# Altium project AMS_Slave.PrjPCB
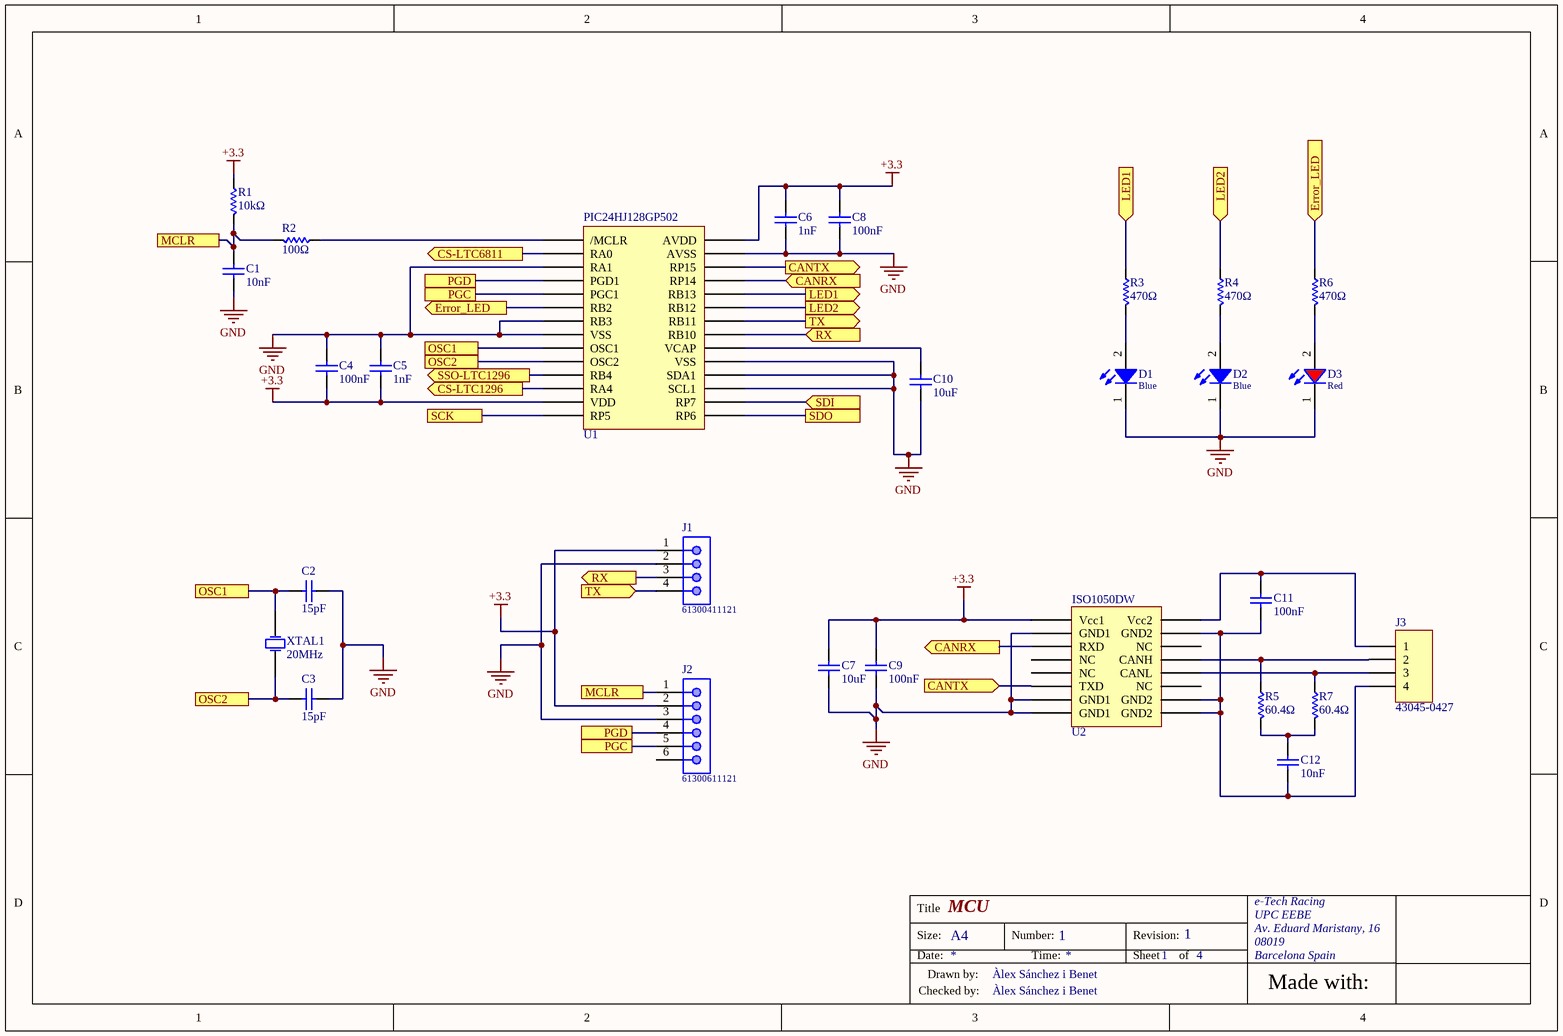
[diagram p0: AMS_MCU.SchDoc]
4 sheets, 190 parts. Net scope: flat (ports and power ports of the same name join across sheets).
Board file: AMS_Slave.PcbDoc
Sheets:
  AMS_MCU.SchDoc
  AMS_balancing.SchDoc
  AMS_supply.SchDoc
  AMS_temperature.SchDoc

## Sheet AMS_MCU.SchDoc: MCU
size A4; CheckedBy: Àlex Sánchez i Benet; DrawnBy: Àlex Sánchez i Benet; DocumentNumber: 1; Revision: 1; SheetNumber: 1; SheetTotal: 4; University: UPC EEBE; City: Barcelona; Country: Spain; CP: 08019; Address: Av. Eduard Maristany, 16

### Parts
C1  10nF  [0805_2x1.25x0.8mm_Reflow Soldering]
C2  15pF  [0805_2x1.25x0.6mm_Reflow Soldering]
C3  15pF  [0805_2x1.25x0.6mm_Reflow Soldering]
C4  100nF  [0805_2x1.25x0.8mm_Reflow Soldering]
C5  1nF  [0805_2x1.25x0.8mm_Reflow Soldering]
C6  1nF  [0805_2x1.25x0.8mm_Reflow Soldering]
C7  10uF  [0805_2x1.25x1.25mm_Reflow Soldering]
C8  100nF  [0805_2x1.25x0.8mm_Reflow Soldering]
C9  100nF  [0805_2x1.25x0.8mm_Reflow Soldering]
C10  10uF  [0805_2x1.25x1.25mm_Reflow Soldering]
C11  100nF  [0805_2x1.25x0.8mm_Reflow Soldering]
C12  10nF  [0805_2x1.25x0.8mm_Reflow Soldering]
D1  Blue  [WL-SMCW_0805]
D2  Blue  [WL-SMCW_0805]
D3  Red  [WL-SMCW_0805]
J1  61300411121  [61300411121]
J2  61300611121  [61300611121]
J3  43045-0427  [43045-0427]
R1  10kΩ  [CR0805]
R2  100Ω  [CR0805]
R3  470Ω  [CR0805]
R4  470Ω  [CR0805]
R5  60.4Ω  [CR0805]
R6  470Ω  [CR0805]
R7  60.4Ω  [CR0805]
U1  PIC24HJ128GP502  [PIC24HJ128GP502]
U2  ISO1050DW  [ISO1050DW]
XTAL1  20MHz  [830028710]

### Ports
CANRX (in), CANRX (out), CANTX (in), CANTX (out), CS-LTC1296 (out), CS-LTC6811 (out), Error_LED (in), Error_LED (out), LED1 (in), LED1 (out), LED2 (in), LED2 (out), MCLR, OSC1, OSC2, PGC, PGD, RX (in), RX (out), SCK, SDI (in), SDO, SSO-LTC1296 (out), TX (in), TX (out)

### Nets
+3.3: C4.1 C5.1 C6.2 C7.2 C8.2 C9.2 J1.1 J2.2 R1.2 U1.13(VDD) U1.28(AVDD) U2.1(Vcc1)
GND: C1.1 C2.2 C3.2 C4.2 C5.2 C6.1 C7.1 C8.1 C9.1 C10.1 D1.1(K) D2.1(K) D3.1(K) J1.2 J2.3 U1.3(RA1) U1.7(RB3) U1.8(VSS) U1.17(SCL1) U1.18(SDA1) U1.19(VSS) U1.27(AVSS) U2.2(GND1) U2.7(GND1) U2.8(GND1)
NetC1_2: C1.2 J2.1 R1.1 R2.1 ; port MCLR
NetC2_1: C2.1 U1.9(OSC1) XTAL1.2(OSC2) ; port OSC1
NetC3_1: C3.1 U1.10(OSC2) XTAL1.1(OSC1) ; port OSC2
NetC10_2: C10.2 U1.20(VCAP)
NetC11_1: C11.1 C12.1 J3.4 U2.9(GND2) U2.10(GND2) U2.15(GND2)
NetC11_2: C11.2 J3.1 U2.16(Vcc2)
NetC12_2: C12.2 R5.1 R7.1
NetD1_2: D1.2(A) R3.1
NetD2_2: D2.2(A) R4.1
NetD3_2: D3.2(A) R6.1
NetJ1_3: J1.3 U1.21(RB10) ; port RX
NetJ1_4: J1.4 U1.22(RB11) ; port TX
NetJ2_4: J2.4 U1.4(PGD1) ; port PGD
NetJ2_5: J2.5 U1.5(PGC1) ; port PGC
NetJ3_2: J3.2 R5.2 U2.13(CANH)
NetJ3_3: J3.3 R7.2 U2.12(CANL)
NetR2_2: R2.2 U1.1(/MCLR)
NetR3_2: R3.2 U1.24(RB13) ; port LED1
NetR4_2: R4.2 U1.23(RB12) ; port LED2
NetR6_2: R6.2 U1.6(RB2) ; port Error_LED
NetR57_1: U1.2(RA0) ; port CS-LTC6811
NetR58_1: U1.14(RP5) ; port SCK
NetR59_1: U1.15(RP6) ; port SDO
NetR60_1: U1.16(RP7) ; port SDI
NetR71_1: U1.11(RB4) ; port SSO-LTC1296
NetR72_1: U1.12(RA4) ; port CS-LTC1296
NetU1_25: U1.25(RP14) U2.3(RXD) ; port CANRX
NetU1_26: U1.26(RP15) U2.6(TXD) ; port CANTX

Not connected (* = marked no-connect by the designer): J2 6; U2 4(NC) 5(NC) 11(NC) 14(NC)

### Notes on the sheet
- Title
- e-Tech Racing
- UPC EEBE
- Size:
- Date:
- Drawn by:
- A4
- Number:
- Time:
- Revision:
- Sheet
- of
- Av. Eduard Maristany, 16
- 08019
- Barcelona Spain
- Made with:
- Checked by:

### Library data of the parts
C1 C12 = 885012207092: WCAP-CSGP Ceramic Capacitors, 0805, X7R, 50V, 10nF; Rated Voltage: 50V DC; ComponentLink1Description: Manufacturer; ComponentLink1URL: http://www.we-online.de; ComponentLink2Description: Datasheet; ComponentLink2URL: http://katalog.we-online.de/pbs/datasheet/885012207092.pdf; Part Number: 885012207092; Publisher: Wurth Elektronik; Size: 0805; Operating Temperature: -55 °C to +125 °C; Value: 10nF; Ceramic Type: X7R
C2 C3 = 885012007052: WCAP-CSGP Ceramic Capacitors, 0805, NP0, 50V, 15pF; Rated Voltage: 50V DC; ComponentLink1Description: Manufacturer; ComponentLink1URL: http://www.we-online.de; ComponentLink2Description: Datasheet; ComponentLink2URL: http://katalog.we-online.de/pbs/datasheet/885012007052.pdf; Part Number: 885012007052; Published Date: Oct. 2017; Publisher: Wurth Elektronik; Size: 0805; Operating Temperature: -55 °C to +125 °C; Value: 15pF; Ceramic Type: NP0
C4 C8 C9 C11 = 885012207098: WCAP-CSGP Ceramic Capacitors, 0805, X7R, 50V, 100nF; Rated Voltage: 50V DC; ComponentLink1Description: Manufacturer; ComponentLink1URL: http://www.we-online.de; ComponentLink2Description: Datasheet; ComponentLink2URL: http://katalog.we-online.de/pbs/datasheet/885012207098.pdf; Part Number: 885012207098; Publisher: Wurth Elektronik; Size: 0805; Operating Temperature: -55 °C to +125 °C; Value: 100nF; Ceramic Type: X7R
C5 C6 = 885012007063: WCAP-CSGP Ceramic Capacitors, 0805, NP0, 50V, 1nF; Rated Voltage: 50V DC; ComponentLink1Description: Manufacturer; ComponentLink1URL: http://www.we-online.de; ComponentLink2Description: Datasheet; ComponentLink2URL: http://katalog.we-online.de/pbs/datasheet/885012007063.pdf; Part Number: 885012007063; Published Date: Oct. 2017; Publisher: Wurth Elektronik; Size: 0805; Operating Temperature: -55 °C to +125 °C; Value: 1nF; Ceramic Type: NP0
C7 C10 = 885012107014: WCAP-CSGP Ceramic Capacitors, 0805, X5R, 16V, 10uF; Rated Voltage: 16V DC; ComponentLink1Description: Manufacturer; ComponentLink1URL: http://www.we-online.de; ComponentLink2Description: Datasheet; ComponentLink2URL: http://katalog.we-online.de/pbs/datasheet/885012107014.pdf; Part Number: 885012107014; Published Date: Oct. 2017; Publisher: Wurth Elektronik; Size: 0805; Operating Temperature: -55 °C to +125 °C; Value: 10uF; Ceramic Type: X5R
D1 D2 = 150080BS75000: SMT Mono-color Chip LED Waterclear WL-SMCW, size 0805, Blue, 3.2 V, 140 deg, 145 mcd; Forward Voltage: 3.2 V; Viewing Angle: 140 deg; Peak Wavelength: 465 nm; Dominant Wavelength: 470 nm; Luminous Intensity: 145 mcd; Chip Technology: InGaN; ComponentLink1Description: Manufacturer; ComponentLink1URL: http://www.we-online.de; ComponentLink2Description: Datasheet; ComponentLink2URL: https://katalog.we-online.de/led/datasheet/150080BS75000.pdf; Part Number: 150080BS75000; Published Date: November 2018; Publisher: Wurth Elektronik; Size: 0805; Operating Temperature: -40 to 85 degC; Emitting Color: Blue; Mounting Technology: SMT; Packaging: Tape and Reel
D3 = 150080RS75000: SMT Mono-color Chip LED Waterclear WL-SMCW, size 0805, Red, 2 V, 140 deg, 150 mcd; Forward Voltage: 2 V; Viewing Angle: 140 deg; Peak Wavelength: 630 nm; Dominant Wavelength: 625 nm; Luminous Intensity: 150 mcd; Chip Technology: AlInGaP; ComponentLink1Description: Manufacturer; ComponentLink1URL: http://www.we-online.de; ComponentLink2Description: Datasheet; ComponentLink2URL: https://katalog.we-online.de/led/datasheet/150080RS75000.pdf; Part Number: 150080RS75000; Published Date: November 2018; Publisher: Wurth Elektronik; Size: 0805; Operating Temperature: -40 to 85 degC; Emitting Color: Red; Mounting Technology: SMT; Packaging: Tape and Reel
J1 = 61300411121: THT Vertical Pin Header WR-PHD, Pitch 2.54 mm, Single Row, 4 pins; Pin Number: 4; Pitch: 2.54 mm; Gender: Male; Rated Current: 3 A; Working Voltage: 250 VAC; Withstanding Voltage: 500 VAC; Contact Resistance: 20 mOhm; ComponentLink1Description: Manufacturer; ComponentLink1URL: http://www.we-online.de; ComponentLink2Description: Datasheet; ComponentLink2URL: https://katalog.we-online.de/em/datasheet/6130xx11121.pdf; Part Number: 61300411121; Published Date: August 2018; Publisher: Wurth Elektronik; Operating Temperature: -40 to 105 degC; Mounting Technology: THT; Packaging: Bag; Row Number: Single; Orientation: Vertical
J2 = 61300611121: THT Vertical Pin Header WR-PHD, Pitch 2.54 mm, Single Row, 6 pins; Pin Number: 6; Pitch: 2.54 mm; Gender: Male; Rated Current: 3 A; Working Voltage: 250 VAC; Withstanding Voltage: 500 VAC; Contact Resistance: 20 mOhm; ComponentLink1Description: Manufacturer; ComponentLink1URL: http://www.we-online.de; ComponentLink2Description: Datasheet; ComponentLink2URL: https://katalog.we-online.de/em/datasheet/6130xx11121.pdf; Part Number: 61300611121; Published Date: August 2018; Publisher: Wurth Elektronik; Operating Temperature: -40 to 105 degC; Mounting Technology: THT; Packaging: Bag; Row Number: Single; Orientation: Vertical
J3 = 43045-0427: Micro-Fit 3.0 Vertical Header, 3.00mm Pitch, Dual Row, 4 Circuits, Black; Manufacturer: Molex; Rated Voltage: 600V DC; Rated Current: 8.5A; Circuits: 4; Operating Temperature: -40° to +105°C; Number of Rows: 2; ComponentLink1Description: Datasheet; ComponentLink1URL: https://www.molex.com/webdocs/datasheets/pdf/en-us/0430450427_PCB_HEADERS.pdf
R1 = CR0805-JW-103ELF: Chip Resistor 0805; Manufacturer: Bourns; ComponentLink1Description: Datasheet; ComponentLink1URL: https://www.bourns.com/docs/product-datasheets/chpreztr.pdf?sfvrsn=566c91f1_11
R2 = CR0805-FX-1000ELF: Chip Resistor 0805; Manufacturer: Bourns; ComponentLink1Description: Datasheet; ComponentLink1URL: https://www.bourns.com/docs/product-datasheets/chpreztr.pdf?sfvrsn=566c91f1_11
R3 R4 R6 = CR0805-FX-4700GLF: Chip Resistor 0805; Manufacturer: Bourns; ComponentLink1Description: Datasheet; ComponentLink1URL: https://www.bourns.com/docs/product-datasheets/chpreztr.pdf?sfvrsn=566c91f1_11
R5 R7 = ERA6AEB60R4V: Chip Resistor 0805; Manufacturer: Panasonic; ComponentLink1Description: Datasheet; ComponentLink1URL: https://www.bourns.com/docs/product-datasheets/chpreztr.pdf?sfvrsn=566c91f1_11
U1 = PIC24HJ128GP502: 16-bit Microcontroller / (up to 128 KB Flash and 8K SRAM) with Advanced Analog; Manufacturer: Microchip; Pins: 28; ComponentLink1Description: Datasheet; ComponentLink1URL: http://ww1.microchip.com/downloads/en/devicedoc/70293g.pdf
U2 = ISO1050DW: Galvanically isolated CAN / transceiver; Manufacturer: Texas Instruments; Pins: 16; ComponentLink1Description: Datasheet; ComponentLink1URL: http://www.ti.com/lit/ds/symlink/iso1050.pdf
XTAL1 = 830028710: Industry standard SMD crystal WE-XTAL Quartz Crystal; Manufacturer: Wurth Elektronik; Model: HC49/4HSMX; ComponentLink1Description: Datasheet; ComponentLink1URL: https://katalog.we-online.com/pbs/datasheet/830028710.pdf; Mounting Technology: SMT; Frequency: 20MHz

## Sheet AMS_balancing.SchDoc: Balancing Stage
size A3 portrait; CheckedBy: Àlex Sánchez i Benet; DrawnBy: Àlex Sánchez i Benet; DocumentNumber: 1; Revision: 1; SheetNumber: 2; SheetTotal: 4
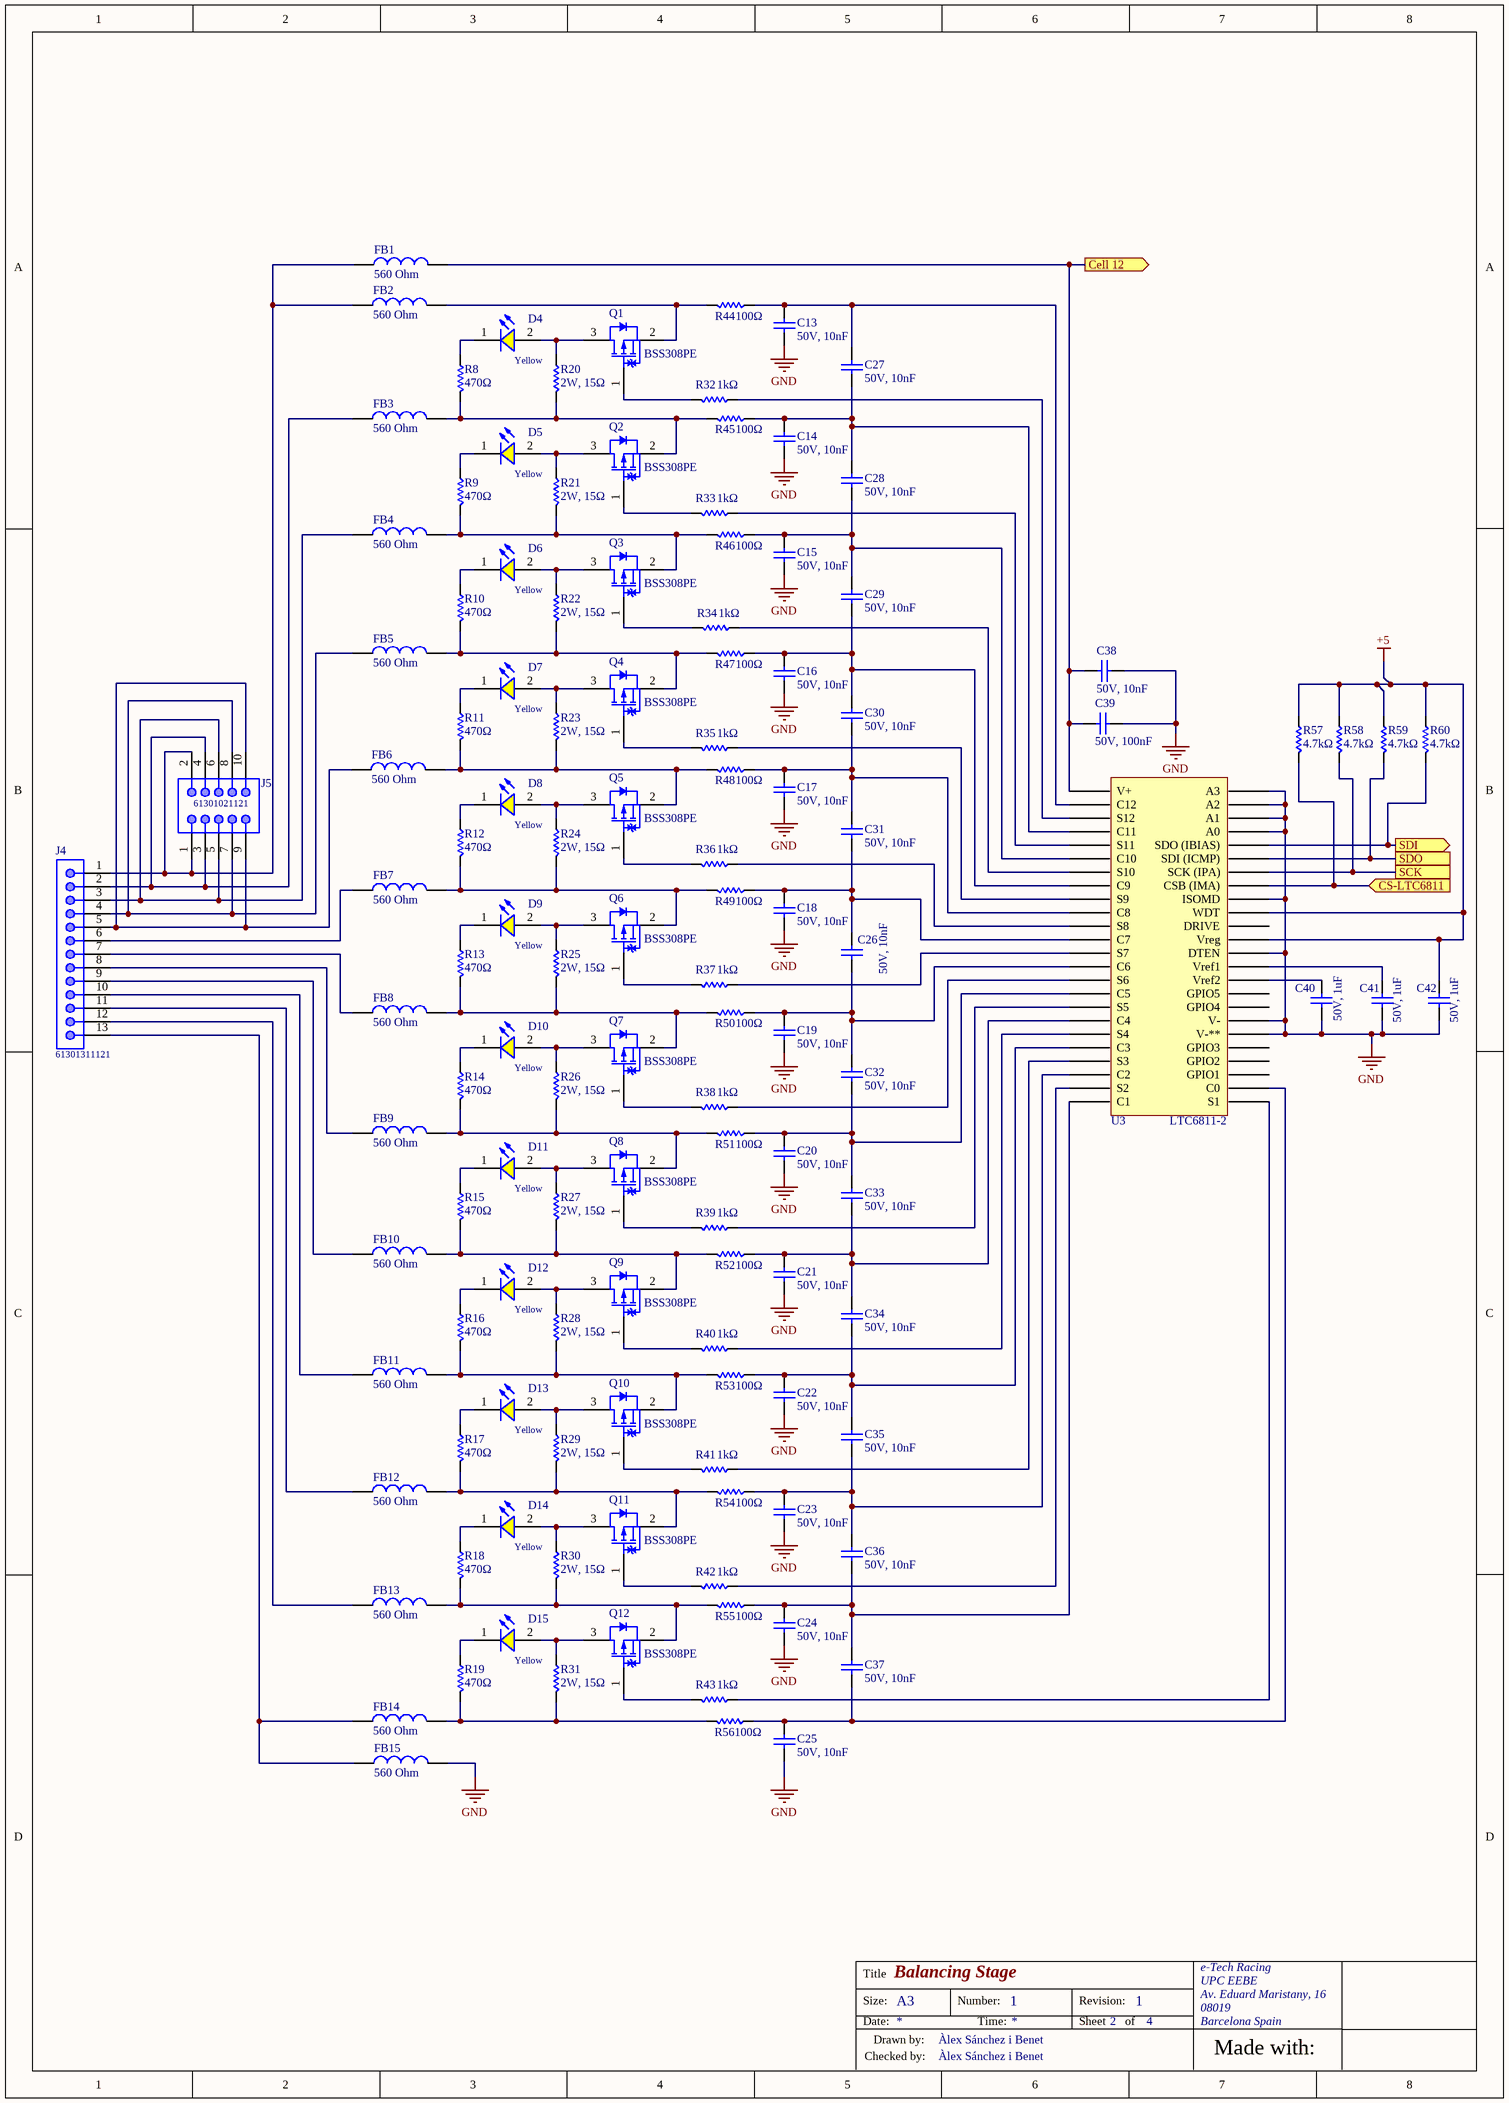
[diagram p1: AMS_balancing.SchDoc]

### Parts
C13  50V, 10nF  [0805_2x1.25x0.8mm_Reflow Soldering]
C14  50V, 10nF  [0805_2x1.25x0.8mm_Reflow Soldering]
C15  50V, 10nF  [0805_2x1.25x0.8mm_Reflow Soldering]
C16  50V, 10nF  [0805_2x1.25x0.8mm_Reflow Soldering]
C17  50V, 10nF  [0805_2x1.25x0.8mm_Reflow Soldering]
C18  50V, 10nF  [0805_2x1.25x0.8mm_Reflow Soldering]
C19  50V, 10nF  [0805_2x1.25x0.8mm_Reflow Soldering]
C20  50V, 10nF  [0805_2x1.25x0.8mm_Reflow Soldering]
C21  50V, 10nF  [0805_2x1.25x0.8mm_Reflow Soldering]
C22  50V, 10nF  [0805_2x1.25x0.8mm_Reflow Soldering]
C23  50V, 10nF  [0805_2x1.25x0.8mm_Reflow Soldering]
C24  50V, 10nF  [0805_2x1.25x0.8mm_Reflow Soldering]
C25  50V, 10nF  [0805_2x1.25x0.8mm_Reflow Soldering]
C26  50V, 10nF  [0805_2x1.25x0.8mm_Reflow Soldering]
C27  50V, 10nF  [0805_2x1.25x0.8mm_Reflow Soldering]
C28  50V, 10nF  [0805_2x1.25x0.8mm_Reflow Soldering]
C29  50V, 10nF  [0805_2x1.25x0.8mm_Reflow Soldering]
C30  50V, 10nF  [0805_2x1.25x0.8mm_Reflow Soldering]
C31  50V, 10nF  [0805_2x1.25x0.8mm_Reflow Soldering]
C32  50V, 10nF  [0805_2x1.25x0.8mm_Reflow Soldering]
C33  50V, 10nF  [0805_2x1.25x0.8mm_Reflow Soldering]
C34  50V, 10nF  [0805_2x1.25x0.8mm_Reflow Soldering]
C35  50V, 10nF  [0805_2x1.25x0.8mm_Reflow Soldering]
C36  50V, 10nF  [0805_2x1.25x0.8mm_Reflow Soldering]
C37  50V, 10nF  [0805_2x1.25x0.8mm_Reflow Soldering]
C38  50V, 10nF  [0805_2x1.25x0.8mm_Reflow Soldering]
C39  50V, 100nF  [0805_2x1.25x0.8mm_Reflow Soldering]
C40  50V, 1uF  [0805_2x1.25x1.25mm_Reflow Soldering]
C41  50V, 1uF  [0805_2x1.25x1.25mm_Reflow Soldering]
C42  50V, 1uF  [0805_2x1.25x1.25mm_Reflow Soldering]
D4  Yellow  [WL-SMCW_0805]
D5  Yellow  [WL-SMCW_0805]
D6  Yellow  [WL-SMCW_0805]
D7  Yellow  [WL-SMCW_0805]
D8  Yellow  [WL-SMCW_0805]
D9  Yellow  [WL-SMCW_0805]
D10  Yellow  [WL-SMCW_0805]
D11  Yellow  [WL-SMCW_0805]
D12  Yellow  [WL-SMCW_0805]
D13  Yellow  [WL-SMCW_0805]
D14  Yellow  [WL-SMCW_0805]
D15  Yellow  [WL-SMCW_0805]
FB1  560 Ohm  [0805_High Current]
FB2  560 Ohm  [0805_High Current]
FB3  560 Ohm  [0805_High Current]
FB4  560 Ohm  [0805_High Current]
FB5  560 Ohm  [0805_High Current]
FB6  560 Ohm  [0805_High Current]
FB7  560 Ohm  [0805_High Current]
FB8  560 Ohm  [0805_High Current]
FB9  560 Ohm  [0805_High Current]
FB10  560 Ohm  [0805_High Current]
FB11  560 Ohm  [0805_High Current]
FB12  560 Ohm  [0805_High Current]
FB13  560 Ohm  [0805_High Current]
FB14  560 Ohm  [0805_High Current]
FB15  560 Ohm  [0805_High Current]
J4  61301311121  [61301311121-bottom]
J5  61301021121  [61301021121]
Q1  BSS308PE  [INF-PG-SOT23_N]
Q2  BSS308PE  [INF-PG-SOT23_N]
Q3  BSS308PE  [INF-PG-SOT23_N]
Q4  BSS308PE  [INF-PG-SOT23_N]
Q5  BSS308PE  [INF-PG-SOT23_N]
Q6  BSS308PE  [INF-PG-SOT23_N]
Q7  BSS308PE  [INF-PG-SOT23_N]
Q8  BSS308PE  [INF-PG-SOT23_N]
Q9  BSS308PE  [INF-PG-SOT23_N]
Q10  BSS308PE  [INF-PG-SOT23_N]
Q11  BSS308PE  [INF-PG-SOT23_N]
Q12  BSS308PE  [INF-PG-SOT23_N]
R8  470Ω  [CR0805]
R9  470Ω  [CR0805]
R10  470Ω  [CR0805]
R11  470Ω  [CR0805]
R12  470Ω  [CR0805]
R13  470Ω  [CR0805]
R14  470Ω  [CR0805]
R15  470Ω  [CR0805]
R16  470Ω  [CR0805]
R17  470Ω  [CR0805]
R18  470Ω  [CR0805]
R19  470Ω  [CR0805]
R20  2W, 15Ω  [352115RFT]
R21  2W, 15Ω  [352115RFT]
R22  2W, 15Ω  [352115RFT]
R23  2W, 15Ω  [352115RFT]
R24  2W, 15Ω  [352115RFT]
R25  2W, 15Ω  [352115RFT]
R26  2W, 15Ω  [352115RFT]
R27  2W, 15Ω  [352115RFT]
R28  2W, 15Ω  [352115RFT]
R29  2W, 15Ω  [352115RFT]
R30  2W, 15Ω  [352115RFT]
R31  2W, 15Ω  [352115RFT]
R32  1kΩ  [CR0805]
R33  1kΩ  [CR0805]
R34  1kΩ  [CR0805]
R35  1kΩ  [CR0805]
R36  1kΩ  [CR0805]
R37  1kΩ  [CR0805]
R38  1kΩ  [CR0805]
R39  1kΩ  [CR0805]
R40  1kΩ  [CR0805]
R41  1kΩ  [CR0805]
R42  1kΩ  [CR0805]
R43  1kΩ  [CR0805]
R44  100Ω  [CR0805]
R45  100Ω  [CR0805]
R46  100Ω  [CR0805]
R47  100Ω  [CR0805]
R48  100Ω  [CR0805]
R49  100Ω  [CR0805]
R50  100Ω  [CR0805]
R51  100Ω  [CR0805]
R52  100Ω  [CR0805]
R53  100Ω  [CR0805]
R54  100Ω  [CR0805]
R55  100Ω  [CR0805]
R56  100Ω  [CR0805]
R57  4.7kΩ  [CR0805]
R58  4.7kΩ  [CR0805]
R59  4.7kΩ  [CR0805]
R60  4.7kΩ  [CR0805]
U3  LTC6811-2  [LTC6811-2]

### Ports
Cell 12 (out), CS-LTC6811 (in), SCK, SDI (out), SDO

### Nets
+5: C42.2 R57.2 R58.2 R59.2 R60.2 U3.37(Vreg) U3.39(WDT)
GND: C13.1 C14.1 C15.1 C16.1 C17.1 C18.1 C19.1 C20.1 C21.1 C22.1 C23.1 C24.1 C25.1 C38.2 C39.2 C40.1 C41.1 C42.1 FB15.2 U3.30(V-**) U3.31(V-) U3.36(DTEN) U3.40(ISOMD) U3.45(A0) U3.46(A1) U3.47(A2) U3.48(A3)
NetC13_2: C13.2 C27.2 R44.2 U3.2(C12)
NetC14_2: C14.2 C27.1 C28.2 R45.2 U3.4(C11)
NetC15_2: C15.2 C28.1 C29.2 R46.2 U3.6(C10)
NetC16_2: C16.2 C29.1 C30.2 R47.2 U3.8(C9)
NetC17_2: C17.2 C30.1 C31.2 R48.2 U3.10(C8)
NetC18_2: C18.2 C26.2 C31.1 R49.2 U3.12(C7)
NetC19_2: C19.2 C26.1 C32.2 R50.2 U3.14(C6)
NetC20_2: C20.2 C32.1 C33.2 R51.2 U3.16(C5)
NetC21_2: C21.2 C33.1 C34.2 R52.2 U3.18(C4)
NetC22_2: C22.2 C34.1 C35.2 R53.2 U3.20(C3)
NetC23_2: C23.2 C35.1 C36.2 R54.2 U3.22(C2)
NetC24_2: C24.2 C36.1 C37.2 R55.2 U3.24(C1)
NetC25_2: C25.2 C37.1 R56.2 U3.26(C0)
NetC38_1: C38.1 C39.1 FB1.2 U3.1(V+) ; port Cell 12
NetC40_2: C40.2 U3.34(Vref2)
NetC41_2: C41.2 U3.35(Vref1)
NetD4_1: D4.1(K) R8.2
NetD4_2: D4.2(A) Q1.3(DRAIN) R20.2
NetD5_1: D5.1(K) R9.2
NetD5_2: D5.2(A) Q2.3(DRAIN) R21.2
NetD6_1: D6.1(K) R10.2
NetD6_2: D6.2(A) Q3.3(DRAIN) R22.2
NetD7_1: D7.1(K) R11.2
NetD7_2: D7.2(A) Q4.3(DRAIN) R23.2
NetD8_1: D8.1(K) R12.2
NetD8_2: D8.2(A) Q5.3(DRAIN) R24.2
NetD9_1: D9.1(K) R13.2
NetD9_2: D9.2(A) Q6.3(DRAIN) R25.2
NetD10_1: D10.1(K) R14.2
NetD10_2: D10.2(A) Q7.3(DRAIN) R26.2
NetD11_1: D11.1(K) R15.2
NetD11_2: D11.2(A) Q8.3(DRAIN) R27.2
NetD12_1: D12.1(K) R16.2
NetD12_2: D12.2(A) Q9.3(DRAIN) R28.2
NetD13_1: D13.1(K) R17.2
NetD13_2: D13.2(A) Q10.3(DRAIN) R29.2
NetD14_1: D14.1(K) R18.2
NetD14_2: D14.2(A) Q11.3(DRAIN) R30.2
NetD15_1: D15.1(K) R19.2
NetD15_2: D15.2(A) Q12.3(DRAIN) R31.2
NetFB1_1: FB1.1 FB2.1 J4.1 J5.1 J5.2
NetFB2_2: FB2.2 Q1.2(SOURCE) R44.1
NetFB3_1: FB3.1 J4.2 J5.3 J5.4
NetFB3_2: FB3.2 Q2.2(SOURCE) R8.1 R20.1 R45.1
NetFB4_1: FB4.1 J4.3 J5.5 J5.6
NetFB4_2: FB4.2 Q3.2(SOURCE) R9.1 R21.1 R46.1
NetFB5_1: FB5.1 J4.4 J5.7 J5.8
NetFB5_2: FB5.2 Q4.2(SOURCE) R10.1 R22.1 R47.1
NetFB6_1: FB6.1 J4.5 J5.9 J5.10
NetFB6_2: FB6.2 Q5.2(SOURCE) R11.1 R23.1 R48.1
NetFB7_1: FB7.1 J4.6
NetFB7_2: FB7.2 Q6.2(SOURCE) R12.1 R24.1 R49.1
NetFB8_1: FB8.1 J4.7
NetFB8_2: FB8.2 Q7.2(SOURCE) R13.1 R25.1 R50.1
NetFB9_1: FB9.1 J4.8
NetFB9_2: FB9.2 Q8.2(SOURCE) R14.1 R26.1 R51.1
NetFB10_1: FB10.1 J4.9
NetFB10_2: FB10.2 Q9.2(SOURCE) R15.1 R27.1 R52.1
NetFB11_1: FB11.1 J4.10
NetFB11_2: FB11.2 Q10.2(SOURCE) R16.1 R28.1 R53.1
NetFB12_1: FB12.1 J4.11
NetFB12_2: FB12.2 Q11.2(SOURCE) R17.1 R29.1 R54.1
NetFB13_1: FB13.1 J4.12
NetFB13_2: FB13.2 Q12.2(SOURCE) R18.1 R30.1 R55.1
NetFB14_1: FB14.1 FB15.1 J4.13
NetFB14_2: FB14.2 R19.1 R31.1 R56.1
NetQ1_1: Q1.1(GATE) R32.1
NetQ2_1: Q2.1(GATE) R33.1
NetQ3_1: Q3.1(GATE) R34.1
NetQ4_1: Q4.1(GATE) R35.1
NetQ5_1: Q5.1(GATE) R36.1
NetQ6_1: Q6.1(GATE) R37.1
NetQ7_1: Q7.1(GATE) R38.1
NetQ8_1: Q8.1(GATE) R39.1
NetQ9_1: Q9.1(GATE) R40.1
NetQ10_1: Q10.1(GATE) R41.1
NetQ11_1: Q11.1(GATE) R42.1
NetQ12_1: Q12.1(GATE) R43.1
NetR32_2: R32.2 U3.3(S12)
NetR33_2: R33.2 U3.5(S11)
NetR34_2: R34.2 U3.7(S10)
NetR35_2: R35.2 U3.9(S9)
NetR36_2: R36.2 U3.11(S8)
NetR37_2: R37.2 U3.13(S7)
NetR38_2: R38.2 U3.15(S6)
NetR39_2: R39.2 U3.17(S5)
NetR40_2: R40.2 U3.19(S4)
NetR41_2: R41.2 U3.21(S3)
NetR42_2: R42.2 U3.23(S2)
NetR43_2: R43.2 U3.25(S1)
NetR57_1: R57.1 U3.41(CSB_(IMA)) ; port CS-LTC6811
NetR58_1: R58.1 U3.42(SCK_(IPA)) ; port SCK
NetR59_1: R59.1 U3.43(SDI_(ICMP)) ; port SDO
NetR60_1: R60.1 U3.44(SDO_(IBIAS)) ; port SDI

Not connected (* = marked no-connect by the designer): U3 27(GPIO1) 28(GPIO2) 29(GPIO3) 32(GPIO4) 33(GPIO5) 38(DRIVE)

### Notes on the sheet
- Title
- e-Tech Racing
- UPC EEBE
- Size:
- Date:
- Drawn by:
- A3
- Number:
- Time:
- Revision:
- Sheet
- of
- Av. Eduard Maristany, 16
- 08019
- Barcelona Spain
- Made with:
- Checked by:

### Library data of the parts
C13-C38 = 885012207092: as C1 on sheet AMS_MCU; ComponentLink1Description: Manufacturer; ComponentLink1URL: http://www.we-online.de; ComponentLink2Description: Datasheet; ComponentLink2URL: http://katalog.we-online.de/pbs/datasheet/885012207092.pdf; Part Number: 885012207092; Publisher: Wurth Elektronik; Size: 0805; Operating Temperature: -55 °C to +125 °C; Value: 10nF; Ceramic Type: X7R
C39 = 885012207098: as C4 on sheet AMS_MCU; ComponentLink1Description: Manufacturer; ComponentLink1URL: http://www.we-online.de; ComponentLink2Description: Datasheet; ComponentLink2URL: http://katalog.we-online.de/pbs/datasheet/885012207098.pdf; Part Number: 885012207098; Publisher: Wurth Elektronik; Size: 0805; Operating Temperature: -55 °C to +125 °C; Value: 100nF; Ceramic Type: X7R
C40-C42 = 885012207103: WCAP-CSGP Ceramic Capacitors, 0805, X7R, 50V, 1uF; Rated Voltage: 50V DC; ComponentLink1Description: Manufacturer; ComponentLink1URL: http://www.we-online.de; ComponentLink2Description: Datasheet; ComponentLink2URL: http://katalog.we-online.de/pbs/datasheet/885012207103.pdf; Part Number: 885012207103; Publisher: Wurth Elektronik; Size: 0805; Operating Temperature: -55 °C to +125 °C; Value: 1uF; Ceramic Type: X7R
D4-D15 = 150080YS75000: SMT Mono-color Chip LED Waterclear WL-SMCW, size 0805, Yellow, 2 V, 140 deg, 120 mcd; Forward Voltage: 2 V; Viewing Angle: 140 deg; Peak Wavelength: 595 nm; Dominant Wavelength: 590 nm; Luminous Intensity: 120 mcd; Chip Technology: AlInGaP; ComponentLink1Description: Manufacturer; ComponentLink1URL: http://www.we-online.de; ComponentLink2Description: Datasheet; ComponentLink2URL: https://katalog.we-online.de/led/datasheet/150080YS75000.pdf; Part Number: 150080YS75000; Publisher: Wurth Elektronik; Size: 0805; Operating Temperature: -40 to 85 degC; Emitting Color: Yellow; Mounting Technology: SMT; Packaging: Tape and Reel
FB1-FB15 = 782853561: WE-CBA SMD EMI Suppression Ferrite Bead, 0805, High Current, 1.5 A, 560 Ohm; Rated Current: 1.5 A; DC Resistance max.: 0.1 Ohm; ComponentLink1Description: Manufacturer; ComponentLink1URL: http://www.we-online.de; ComponentLink2Description: Datasheet; ComponentLink2URL: http://katalog.we-online.de/pbs/datasheet/782853561.pdf; Part Number: 782853561; Published Date: Oct. 2017; Publisher: Wurth Elektronik; Size: 0805; Type: High Current; Impedance: 560 Ohm; Operating Temperature: -55 to 125 degC
J4 = 61301311121: THT Vertical Pin Header WR-PHD, Pitch 2.54 mm, Single Row, 13 pins; Pin Number: 13; Pitch: 2.54 mm; Gender: Male; Rated Current: 3 A; Working Voltage: 250 VAC; Withstanding Voltage: 500 VAC; Contact Resistance: 20 mOhm; ComponentLink1Description: Manufacturer; ComponentLink1URL: http://www.we-online.de; ComponentLink2Description: Datasheet; ComponentLink2URL: https://katalog.we-online.de/em/datasheet/6130xx11121.pdf; Part Number: 61301311121; Published Date: August 2018; Publisher: Wurth Elektronik; Operating Temperature: -40 to 105 degC; Mounting Technology: THT; Packaging: Bag; Row Number: Single; Orientation: Vertical
J5 = 61301021121: THT Vertical Pin Header WR-PHD, Pitch 2.54 mm, Dual Row, 10 pins; Pin Number: 10; Pitch: 2.54 mm; Gender: Male; Rated Current: 3 A; Working Voltage: 250 VAC; Withstanding Voltage: 500 VAC; Contact Resistance: 20 mOhm; ComponentLink1Description: Manufacturer; ComponentLink1URL: http://www.we-online.de; ComponentLink2Description: Datasheet; ComponentLink2URL: https://katalog.we-online.de/em/datasheet/6130xx21121.pdf; Part Number: 61301021121; Publisher: Wurth Elektronik; Operating Temperature: -40 to 105 degC; Mounting Technology: THT; Packaging: Bag; Row Number: Dual; Orientation: Vertical
Q1-Q12 = BSS308PE: P-Channel OptiMOS P3 Small-Signal-Transistor, -30 V VDS, -2 A ID, -55 to 150 degC, PG-SOT23, Reel, Green; Manufacturer: Infineon; Green: TRUE; ID (max): -2 A; IDpuls (max): -8 A; Pto t (max): 0.5 W; QG: -5 nC; RDS (on) (max): 80 mOhm; RDS (on) (max) (@4.5V): 130 mOhm; Rth: 250 K/W; VDS (max): -30 V; VGS(th) (max): -1 V; VGS(th) (min): -2 V; PackageReference: PG-SOT23; PackageDescription: 3-Pin Small Outline Transistor Package, 2.9 x 1.3 mm Body, 0.95 mm Pitch; Halogen-free: TRUE; Mounting Technology: Surface Mount; PartNumber: BSS308PE; ComponentLink1Description: Manufacturer URL; ComponentLink1URL: http://www.infineon.com/; ComponentLink2Description: Datasheet; ComponentLink2URL: http://www.infineon.com/dgdl/BSS308PE_Rev23_.pdf?folderId=db3a304314dca38901154a72e3951a65&fileId=db3a304330f686060131099c80400073; ComponentLink3Description: Package Specification; ComponentLink3URL: http://www.infineon.com/dgdl/SOT23-Package_Overview.pdf?folderId=db3a30431936bc4b0119532290053c66&fileId=db3a30431936bc4b0119533468123c85
R8-R19 = CR0805-FX-4700GLF: Chip Resistor 0805; Manufacturer: Bourns; ComponentLink1Description: Datasheet; ComponentLink1URL: https://www.bourns.com/docs/product-datasheets/chpreztr.pdf?sfvrsn=566c91f1_11
R20-R31 = 352115RFT: SMD Power Resistor, Type 3521 Series; Manufacturer: TE Connectivity; Value: 15Ω; Power Rating: 2W; ComponentLink1Description: Datasheet; ComponentLink1URL: https://www.te.com/commerce/DocumentDelivery/DDEController?Action=showdoc&DocId=Data+Sheet%7F9-1773463-5%7FD%7Fpdf%7FEnglish%7FENG_DS_9-1773463-5_D.pdf%7F2176070-5
R32-R43 = CR0805-JW-102ELF: Chip Resistor 0805; Manufacturer: Bourns; ComponentLink1Description: Datasheet; ComponentLink1URL: https://www.bourns.com/docs/product-datasheets/chpreztr.pdf?sfvrsn=566c91f1_11
R44-R56 = CR0805-FX-1000ELF: Chip Resistor 0805; Manufacturer: Bourns; ComponentLink1Description: Datasheet; ComponentLink1URL: https://www.bourns.com/docs/product-datasheets/chpreztr.pdf?sfvrsn=566c91f1_11
R57-R60 = CR0805-FX-4701GLF: Chip Resistor 0805; Manufacturer: Bourns; ComponentLink1Description: Datasheet; ComponentLink1URL: https://www.bourns.com/docs/product-datasheets/chpreztr.pdf?sfvrsn=566c91f1_11
U3 = LTC6811-2: Multicell Battery Monitors; Manufacturer: Analog Devices; Datasheet: https://www.analog.com/media/en/technical-documentation/data-sheets/68111fb.pdf; Pins: 48; ComponentLink1Description: Datasheet; ComponentLink1URL: https://www.analog.com/media/en/technical-documentation/data-sheets/68111fb.pdf

## Sheet AMS_supply.SchDoc: Supply Circuit
size A4; CheckedBy: Àlex Sánchez i Benet; DrawnBy: Àlex Sánchez i Benet; DocumentNumber: 1; Revision: 1; SheetNumber: 3; SheetTotal: 4; University: UPC EEBE; City: Barcelona; Country: Spain; CP: 08019; Address: Av. Eduard Maristany, 16
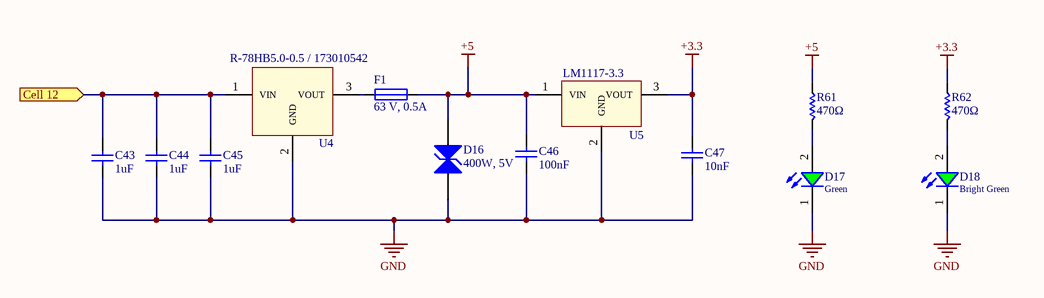
[diagram p2: AMS_supply.SchDoc]

### Parts
C43  1uF  [0805_2x1.25x1.25mm_Reflow Soldering]
C44  1uF  [0805_2x1.25x1.25mm_Reflow Soldering]
C45  1uF  [0805_2x1.25x1.25mm_Reflow Soldering]
C46  100nF  [0805_2x1.25x0.8mm_Reflow Soldering]
C47  10nF  [0805_2x1.25x0.8mm_Reflow Soldering]
D16  400W, 5V  [WE-TVSP_DO-214AC_Bidirectional]
D17  Green  [WL-SMCW_0805]
D18  Bright Green  [WL-SMCW_0805]
F1  63 V, 0.5A  [437 Series]
R61  470Ω  [CR0805]
R62  470Ω  [CR0805]
U4  R-78HB5.0-0.5 / 173010542  [R-78HB5.0-0.5]  (value not drawn)
U5  Reference: LM1117-3.3  [LM1117IMP3.3]  (hidden comment: 1.5 - 13.8 Vin, 3.3 Vout)

### Ports
Cell 12 (in)

### Nets
+3.3: C47.2 R62.2 U5.3(VOUT)
+5: C46.2 D16.2(C) F1.2 R61.2 U5.1(VIN)
GND: C43.1 C44.1 C45.1 C46.1 C47.1 D16.1(C) D17.1(K) D18.1(K) U4.2(GND) U5.2(GND)
NetC38_1: C43.2 C44.2 C45.2 U4.1(VIN) ; port Cell 12
NetD17_2: D17.2(A) R61.1
NetD18_2: D18.2(A) R62.1
NetF1_1: F1.1 U4.3(VOUT)

### Notes on the sheet
- R-78HB5.0-0.5 / 173010542
- Title
- e-Tech Racing
- UPC EEBE
- Size:
- Date:
- Drawn by:
- A4
- Number:
- Time:
- Revision:
- Sheet
- of
- Av. Eduard Maristany, 16
- 08019
- Barcelona Spain
- Made with:
- Checked by:

### Library data of the parts
C43-C45 = 885012207103: as C40 on sheet AMS_balancing; ComponentLink1Description: Manufacturer; ComponentLink1URL: http://www.we-online.de; ComponentLink2Description: Datasheet; ComponentLink2URL: http://katalog.we-online.de/pbs/datasheet/885012207103.pdf; Part Number: 885012207103; Publisher: Wurth Elektronik; Size: 0805; Operating Temperature: -55 °C to +125 °C; Value: 1uF; Ceramic Type: X7R
C46 = 885012207098: as C4 on sheet AMS_MCU; ComponentLink1Description: Manufacturer; ComponentLink1URL: http://www.we-online.de; ComponentLink2Description: Datasheet; ComponentLink2URL: http://katalog.we-online.de/pbs/datasheet/885012207098.pdf; Part Number: 885012207098; Publisher: Wurth Elektronik; Size: 0805; Operating Temperature: -55 °C to +125 °C; Value: 100nF; Ceramic Type: X7R
C47 = 885012207092: as C1 on sheet AMS_MCU; ComponentLink1Description: Manufacturer; ComponentLink1URL: http://www.we-online.de; ComponentLink2Description: Datasheet; ComponentLink2URL: http://katalog.we-online.de/pbs/datasheet/885012207092.pdf; Part Number: 885012207092; Publisher: Wurth Elektronik; Size: 0805; Operating Temperature: -55 °C to +125 °C; Value: 10nF; Ceramic Type: X7R
D16 = 824501500: WE-TVSP Power TVS Diode, size DO-214AC, Bidirectional, 400 W, 5 VDC; Manufacturer: Wurth Elektronik; Peak Pulse Current: 43.5 A; Reverse Breakdown Voltage: 6.7 V; Surge Clamping Voltage: 9.2 V; ComponentLink1Description: Manufacturer; ComponentLink1URL: http://www.we-online.de; ComponentLink2Description: Datasheet; ComponentLink2URL: https://katalog.we-online.de/pbs/datasheet/824501500.pdf; Part Number: 824501500; Size: DO-214AC; Operating Temperature: -65ºC to 150 ºC; Mounting Technology: SMT; Packaging: Tape and Reel; Polarity: Bidirectional; Power Dissipation: 400 W; Reverse Stand-Off Voltage: 5 V
D17 = 150080GS75000: SMT Mono-color Chip LED Waterclear WL-SMCW, size 0805, Green, 3.2 V, 140 deg, 450 mcd; Forward Voltage: 3.2 V; Viewing Angle: 140 deg; Peak Wavelength: 515 nm; Dominant Wavelength: 525 nm; Luminous Intensity: 450 mcd; Chip Technology: InGaN; ComponentLink1Description: Manufacturer; ComponentLink1URL: http://www.we-online.de; ComponentLink2Description: Datasheet; ComponentLink2URL: https://katalog.we-online.de/led/datasheet/150080GS75000.pdf; Part Number: 150080GS75000; Published Date: November 2018; Publisher: Wurth Elektronik; Size: 0805; Operating Temperature: -40 to 85 degC; Emitting Color: Green; Mounting Technology: SMT; Packaging: Tape and Reel
D18 = 150080VS75000: SMT Mono-color Chip LED Waterclear WL-SMCW, size 0805, Bright Green, 2 V, 140 deg, 40 mcd; Forward Voltage: 2 V; Viewing Angle: 140 deg; Peak Wavelength: 572 nm; Dominant Wavelength: 570 nm; Luminous Intensity: 40 mcd; Chip Technology: AlInGaP; ComponentLink1Description: Manufacturer; ComponentLink1URL: http://www.we-online.de; ComponentLink2Description: Datasheet; ComponentLink2URL: https://katalog.we-online.de/led/datasheet/150080VS75000.pdf; Part Number: 150080VS75000; Published Date: November 2018; Publisher: Wurth Elektronik; Size: 0805; Operating Temperature: -40 to 85 degC; Emitting Color: Bright Green; Mounting Technology: SMT; Packaging: Tape and Reel
F1 = 0437.500A: 437A Series Fuse; Manufacturer: Littlefuse; ComponentLink1Description: Datasheet; ComponentLink1URL: https://www.littelfuse.com/~/media/electronics/datasheets/fuses/littelfuse_fuse_437a_datasheet.pdf.pdf
R61 R62 = CR0805-FX-4700GLF: Chip Resistor 0805; Manufacturer: Bourns; ComponentLink1Description: Datasheet; ComponentLink1URL: https://www.bourns.com/docs/product-datasheets/chpreztr.pdf?sfvrsn=566c91f1_11
U4 = R-78HB5.0-0.5: High efficiency, high input voltage switching regulator.; ComponentLink1Description: Datasheet R-78HB5.0-0.5; ComponentLink1URL: https://www.recom-power.com/pdf/Innoline/R-78HBxx-0.5_L.pdf; ComponentLink2Description: Datasheet 173010542; ComponentLink2URL: https://katalog.we-online.de/pm/datasheet/173010542.pdf
U5 = LM1117IMP-3.3/NOPB: 800-mA Low-Dropout Linear Regulator; Manufacturer: Texas Instruments; Output Voltage: 3.3 V; Output Current: 800 mA; Input Voltage: 1.5-13.8 V; ComponentLink1Description: Datasheet; ComponentLink1URL: http://www.ti.com/lit/ds/symlink/lm1117.pdf

## Sheet AMS_temperature.SchDoc: Temperature Sensing
size A4; CheckedBy: Àlex Sánchez i Benet; DrawnBy: Àlex Sánchez i Benet; DocumentNumber: 1; Revision: 1; SheetNumber: 4; SheetTotal: 4; University: UPC EEBE; City: Barcelona; Country: Spain; CP: 08019; Address: Av. Eduard Maristany, 16
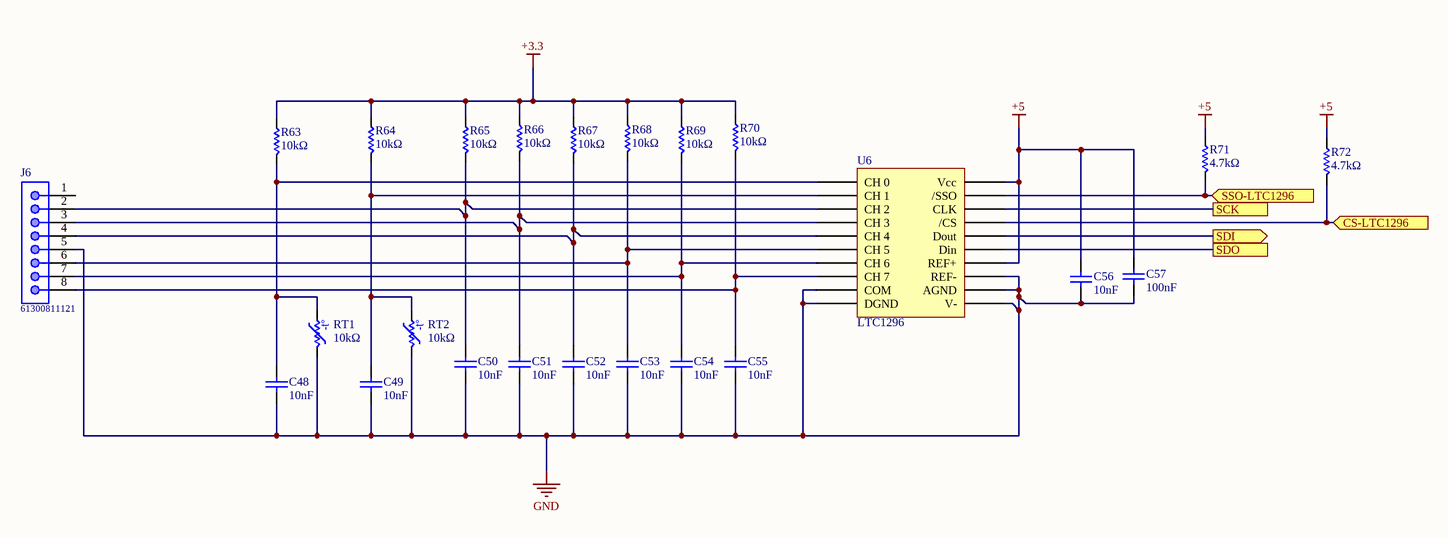
[diagram p3: AMS_temperature.SchDoc]

### Parts
C48  10nF  [0805_2x1.25x0.8mm_Reflow Soldering]
C49  10nF  [0805_2x1.25x0.8mm_Reflow Soldering]
C50  10nF  [0805_2x1.25x0.8mm_Reflow Soldering]
C51  10nF  [0805_2x1.25x0.8mm_Reflow Soldering]
C52  10nF  [0805_2x1.25x0.8mm_Reflow Soldering]
C53  10nF  [0805_2x1.25x0.8mm_Reflow Soldering]
C54  10nF  [0805_2x1.25x0.8mm_Reflow Soldering]
C55  10nF  [0805_2x1.25x0.8mm_Reflow Soldering]
C56  10nF  [0805_2x1.25x0.8mm_Reflow Soldering]
C57  100nF  [0805_2x1.25x0.8mm_Reflow Soldering]
J6  61300811121  [61300811121-bottom]
R63  10kΩ  [CR0805]
R64  10kΩ  [CR0805]
R65  10kΩ  [CR0805]
R66  10kΩ  [CR0805]
R67  10kΩ  [CR0805]
R68  10kΩ  [CR0805]
R69  10kΩ  [CR0805]
R70  10kΩ  [CR0805]
R71  4.7kΩ  [CR0805]
R72  4.7kΩ  [CR0805]
RT1  10kΩ  [NXRT15XV103FA1B040]
RT2  10kΩ  [NXRT15XV103FA1B040]
U6  LTC1296  [LTC1296]

### Ports
CS-LTC1296 (in), SCK, SDI (out), SDO, SSO-LTC1296 (in)

### Nets
+3.3: R63.2 R64.2 R65.2 R66.2 R67.2 R68.2 R69.2 R70.2
+5: C56.2 C57.2 R71.2 R72.2 U6.14(REF+) U6.20(Vcc)
GND: C48.1 C49.1 C50.1 C51.1 C52.1 C53.1 C54.1 C55.1 C56.1 C57.1 J6.5 RT1.1 RT2.1 U6.9(COM) U6.10(DGND) U6.11(V-) U6.12(AGND) U6.13(REF-)
NetC48_2: C48.2 R63.1 RT1.2 U6.1(CH_0)
NetC49_2: C49.2 R64.1 RT2.2 U6.2(CH_1)
NetC50_2: C50.2 J6.2 R65.1 U6.3(CH_2)
NetC51_2: C51.2 J6.3 R66.1 U6.4(CH_3)
NetC52_2: C52.2 J6.4 R67.1 U6.5(CH_4)
NetC53_2: C53.2 J6.6 R68.1 U6.6(CH_5)
NetC54_2: C54.2 J6.7 R69.1 U6.7(CH_6)
NetC55_2: C55.2 J6.8 R70.1 U6.8(CH_7)
NetR58_1: U6.18(CLK) ; port SCK
NetR59_1: U6.15(Din) ; port SDO
NetR60_1: U6.16(Dout) ; port SDI
NetR71_1: R71.1 U6.19(/SSO) ; port SSO-LTC1296
NetR72_1: R72.1 U6.17(/CS) ; port CS-LTC1296

Not connected (* = marked no-connect by the designer): J6 1

### Notes on the sheet
- Title
- e-Tech Racing
- UPC EEBE
- Size:
- Date:
- Drawn by:
- A4
- Number:
- Time:
- Revision:
- Sheet
- of
- Av. Eduard Maristany, 16
- 08019
- Barcelona Spain
- Made with:
- Checked by:
- (in symbol NXRT15XV103FA1B040) -t°

### Library data of the parts
C48-C56 = 885012207092: as C1 on sheet AMS_MCU; ComponentLink1Description: Manufacturer; ComponentLink1URL: http://www.we-online.de; ComponentLink2Description: Datasheet; ComponentLink2URL: http://katalog.we-online.de/pbs/datasheet/885012207092.pdf; Part Number: 885012207092; Publisher: Wurth Elektronik; Size: 0805; Operating Temperature: -55 °C to +125 °C; Value: 10nF; Ceramic Type: X7R
C57 = 885012207098: as C4 on sheet AMS_MCU; ComponentLink1Description: Manufacturer; ComponentLink1URL: http://www.we-online.de; ComponentLink2Description: Datasheet; ComponentLink2URL: http://katalog.we-online.de/pbs/datasheet/885012207098.pdf; Part Number: 885012207098; Publisher: Wurth Elektronik; Size: 0805; Operating Temperature: -55 °C to +125 °C; Value: 100nF; Ceramic Type: X7R
J6 = 61300811121: THT Vertical Pin Header WR-PHD, Pitch 2.54 mm, Single Row, 8 pins; Pin Number: 8; Pitch: 2.54 mm; Gender: Male; Rated Current: 3 A; Working Voltage: 250 VAC; Withstanding Voltage: 500 VAC; Contact Resistance: 20 mOhm; ComponentLink1Description: Manufacturer; ComponentLink1URL: http://www.we-online.de; ComponentLink2Description: Datasheet; ComponentLink2URL: https://katalog.we-online.de/em/datasheet/6130xx11121.pdf; Part Number: 61300811121; Published Date: August 2018; Publisher: Wurth Elektronik; Operating Temperature: -40 to 105 degC; Mounting Technology: THT; Packaging: Bag; Row Number: Single; Orientation: Vertical
R63-R70 = CR0805-JW-103ELF: Chip Resistor 0805; Manufacturer: Bourns; ComponentLink1Description: Datasheet; ComponentLink1URL: https://www.bourns.com/docs/product-datasheets/chpreztr.pdf?sfvrsn=566c91f1_11
R71 R72 = CR0805-FX-4701GLF: Chip Resistor 0805; Manufacturer: Bourns; ComponentLink1Description: Datasheet; ComponentLink1URL: https://www.bourns.com/docs/product-datasheets/chpreztr.pdf?sfvrsn=566c91f1_11
RT1 RT2 = NXRT15XV103FA1B040: NTC Thermistor Leaded type NXRT Series; Manufacturer: Murata; ComponentLink1Description: Datasheet; ComponentLink1URL: https://www.murata.com/en-global/products/productdata/8796838297630/S0423E.pdf?1482204603000; ComponentLink2Description: Catalog; ComponentLink2URL: https://www.murata.com/~/media/webrenewal/support/library/catalog/products/thermistor/ntc/r44e.ashx?la=en; Reference: NXRT15XV103FA1B040
U6 = LTC1296: ADC. Single Chip 12-Bit Data Acquisition System.; Manufacturer: Linear; NumberOfChannels: 8; Resolution: 12 bits; SupplyCurrent: 6 mA; SupplyVoltage: +/- 5V; Pins: 20; ComponentLink1Description: Datasheet; ComponentLink1URL: https://www.analog.com/media/en/technical-documentation/data-sheets/129346fs.pdf

## Nets that join several sheets
+3.3: AMS_MCU (12 pins), AMS_supply (C47.2 R62.2 U5.3), AMS_temperature (8 pins)
+5: AMS_balancing (7 pins), AMS_supply (5 pins), AMS_temperature (6 pins)
GND: AMS_MCU (25 pins), AMS_balancing (27 pins), AMS_supply (10 pins), AMS_temperature (18 pins)
NetC38_1: AMS_balancing (C38.1 C39.1 FB1.2 U3.1), AMS_supply (C43.2 C44.2 C45.2 U4.1)
NetR57_1: AMS_MCU (U1.2), AMS_balancing (R57.1 U3.41)
NetR58_1: AMS_MCU (U1.14), AMS_balancing (R58.1 U3.42), AMS_temperature (U6.18)
NetR59_1: AMS_MCU (U1.15), AMS_balancing (R59.1 U3.43), AMS_temperature (U6.15)
NetR60_1: AMS_MCU (U1.16), AMS_balancing (R60.1 U3.44), AMS_temperature (U6.16)
NetR71_1: AMS_MCU (U1.11), AMS_temperature (R71.1 U6.19)
NetR72_1: AMS_MCU (U1.12), AMS_temperature (R72.1 U6.17)